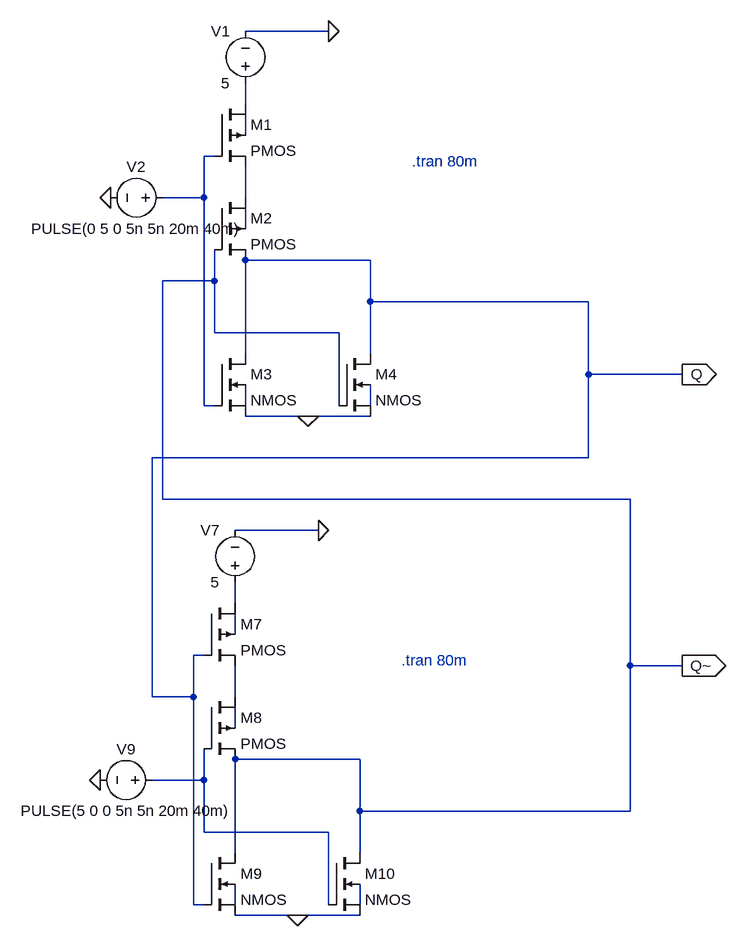
[diagram p0: schematic RSLATCH.asc]
RSLATCH.asc, the LTspice schematic file:
Version 4
SHEET 1 880 1124
WIRE 208 -256 80 -256
WIRE 80 -144 80 -176
WIRE 80 -96 80 -128
WIRE 32 -64 16 -64
WIRE 16 0 16 -64
WIRE 16 0 -48 0
WIRE 80 0 80 -48
WIRE 80 48 80 16
WIRE 272 96 80 96
WIRE 32 128 32 80
WIRE 32 128 -48 128
WIRE 272 160 272 96
WIRE 608 160 272 160
WIRE 32 208 32 128
WIRE 224 208 32 208
WIRE 80 240 80 96
WIRE 272 240 272 160
WIRE 608 272 608 160
WIRE 752 272 608 272
WIRE 16 320 16 0
WIRE 32 320 16 320
WIRE 80 320 80 288
WIRE 224 320 224 208
WIRE 272 320 272 288
WIRE 176 336 80 336
WIRE 272 336 176 336
WIRE 608 400 608 272
WIRE 608 400 -64 400
WIRE -48 464 -48 128
WIRE 672 464 -48 464
WIRE 192 512 64 512
WIRE 64 624 64 592
WIRE 64 672 64 640
WIRE 16 704 0 704
WIRE 672 720 672 464
WIRE 752 720 672 720
WIRE -64 768 -64 400
WIRE 0 768 0 704
WIRE 0 768 -64 768
WIRE 64 768 64 720
WIRE 64 816 64 784
WIRE 256 864 64 864
WIRE 16 896 16 848
WIRE 16 896 -64 896
WIRE 256 944 256 864
WIRE 672 944 672 720
WIRE 672 944 256 944
WIRE 16 976 16 896
WIRE 208 976 16 976
WIRE 64 1008 64 864
WIRE 256 1008 256 944
WIRE 0 1088 0 768
WIRE 16 1088 0 1088
WIRE 64 1088 64 1056
WIRE 208 1088 208 976
WIRE 256 1088 256 1056
WIRE 160 1104 64 1104
WIRE 256 1104 160 1104
FLAG 176 336 0
FLAG 208 -256 0
FLAG -128 0 0
FLAG 160 1104 0
FLAG 192 512 0
FLAG -144 896 0
FLAG 752 272 Q
IOPIN 752 272 Out
FLAG 752 720 Q~
IOPIN 752 720 Out
SYMBOL pmos4 32 -144 R0
SYMATTR InstName M1
SYMBOL pmos4 32 0 R0
SYMATTR InstName M2
SYMBOL nmos4 32 240 R0
SYMATTR InstName M3
SYMBOL nmos4 224 240 R0
SYMATTR InstName M4
SYMBOL voltage 80 -160 R180
WINDOW 0 24 96 Left 2
WINDOW 3 24 16 Left 2
WINDOW 123 0 0 Left 0
WINDOW 39 0 0 Left 0
SYMATTR InstName V1
SYMATTR Value 5
SYMBOL voltage -32 0 R90
WINDOW 0 -32 56 VBottom 2
WINDOW 3 32 56 VTop 2
WINDOW 123 0 0 Left 0
WINDOW 39 0 0 Left 0
SYMATTR InstName V2
SYMATTR Value PULSE(0 5 0 5n 5n 20m 40m)
SYMBOL pmos4 16 624 R0
SYMATTR InstName M7
SYMBOL pmos4 16 768 R0
SYMATTR InstName M8
SYMBOL nmos4 16 1008 R0
SYMATTR InstName M9
SYMBOL nmos4 208 1008 R0
SYMATTR InstName M10
SYMBOL voltage 64 608 R180
WINDOW 0 24 96 Left 2
WINDOW 3 24 16 Left 2
WINDOW 123 0 0 Left 0
WINDOW 39 0 0 Left 0
SYMATTR InstName V7
SYMATTR Value 5
SYMBOL voltage -48 896 R90
WINDOW 0 -32 56 VBottom 2
WINDOW 3 32 56 VTop 2
WINDOW 123 0 0 Left 0
WINDOW 39 0 0 Left 0
SYMATTR InstName V9
SYMATTR Value PULSE(5 0 0 5n 5n 20m 40m)
TEXT 336 -56 Left 2 !.tran 80m
TEXT 336 -56 Left 2 ;.tran 80m
TEXT 320 712 Left 2 ;.tran 80m
TEXT 320 712 Left 2 ;.tran 80m

The netlist it stands for:
* RSLATCH.asc
M1 N001 N003 N004 N002 PMOS
M2 N004 Q~ Q N005 PMOS
M3 Q N003 0 N006 NMOS
M4 Q Q~ 0 N007 NMOS
V1 N001 0 5
V2 N003 0 PULSE(0 5 0 5n 5n 20m 40m)
M7 N008 Q N010 N009 PMOS
M8 N010 N012 Q~ N011 PMOS
M9 Q~ Q 0 N013 NMOS
M10 Q~ N012 0 N014 NMOS
V7 N008 0 5
V9 N012 0 PULSE(5 0 0 5n 5n 20m 40m)
.model NMOS NMOS
.model PMOS PMOS
.lib standard.mos
.tran 80m
* .tran 80m
* .tran 80m
* .tran 80m
.backanno
.end

* Results of the author's LTspice run, read from the files saved beside the schematic
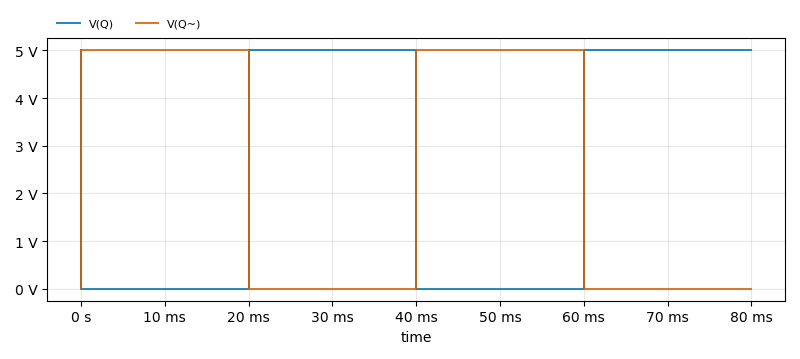
[diagram p1: Transient Analysis of RSLATCH.asc, plotted from the saved traces]
* Transient Analysis, 1 run:
*   V(Q): min 0 V, max 5 V, average 2.5 V, rms 3.536 V, last 5 V
*   V(Q~): min 0 V, max 5 V, average 2.5 V, rms 3.536 V, last 0 V